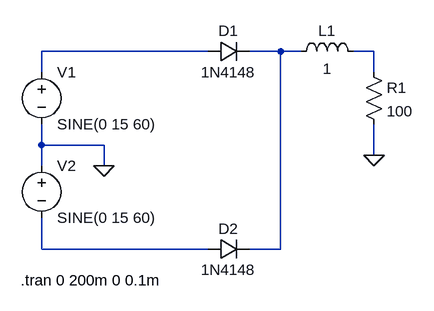
[diagram p0: schematic retificador_trafo_terminação_central_RL.asc]
retificador_trafo_terminação_central_RL.asc, the LTspice schematic file:
Version 4
SHEET 1 880 680
WIRE 240 -64 -16 -64
WIRE 352 -64 304 -64
WIRE 384 -64 352 -64
WIRE 496 -64 464 -64
WIRE -16 -32 -16 -64
WIRE 496 -32 496 -64
WIRE -16 80 -16 48
WIRE 80 80 -16 80
WIRE 496 96 496 48
WIRE -16 112 -16 80
WIRE 80 112 80 80
WIRE -16 240 -16 192
WIRE 240 240 -16 240
WIRE 352 240 352 -64
WIRE 352 240 304 240
FLAG 80 112 0
FLAG 496 96 0
SYMBOL diode 240 -48 R270
WINDOW 0 32 32 VTop 2
WINDOW 3 0 32 VBottom 2
SYMATTR InstName D1
SYMATTR Value 1N4148
SYMBOL diode 240 256 R270
WINDOW 0 32 32 VTop 2
WINDOW 3 0 32 VBottom 2
SYMATTR InstName D2
SYMATTR Value 1N4148
SYMBOL voltage -16 -48 R0
WINDOW 123 0 0 Left 0
WINDOW 39 0 0 Left 0
SYMATTR InstName V1
SYMATTR Value SINE(0 15 60)
SYMBOL voltage -16 96 R0
WINDOW 123 0 0 Left 0
WINDOW 39 0 0 Left 0
SYMATTR InstName V2
SYMATTR Value SINE(0 15 60)
SYMBOL res 480 -48 R0
SYMATTR InstName R1
SYMATTR Value 100
SYMBOL ind 368 -48 R270
WINDOW 0 32 56 VTop 2
WINDOW 3 5 56 VBottom 2
SYMATTR InstName L1
SYMATTR Value 1
TEXT -48 288 Left 2 !.tran 0 200m 0 0.1m

The netlist it stands for:
* retificador_trafo_terminação_central_RL.asc
D1 N001 N002 1N4148
D2 N004 N002 1N4148
V1 N001 0 SINE(0 15 60)
V2 0 N004 SINE(0 15 60)
R1 N003 0 100
L1 N002 N003 1
.model D D
.lib standard.dio
.tran 0 200m 0 0.1m
.backanno
.end